# Altium schematic sheet LithiumChargerShematics.SchDoc
size A4
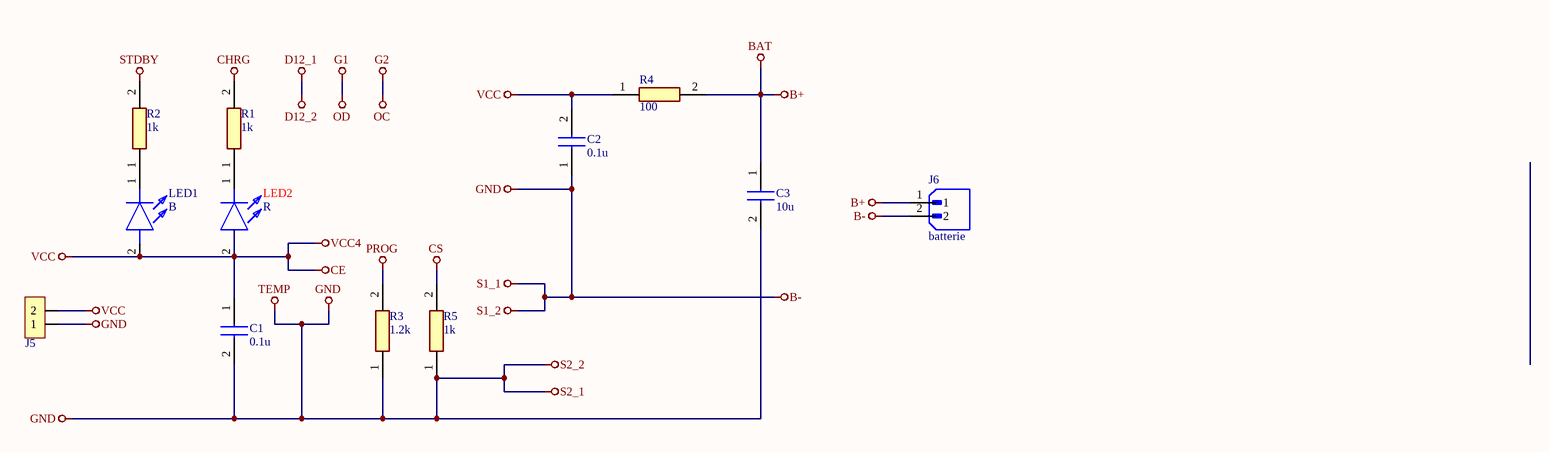
[diagram p0: LithiumChargerShematics.SchDoc]

## Parts
C1  0.1u  [CAPC2012X94N]
C2  0.1u  [CAPC2013X140N]
C3  10u  [CAPC2013X140N]
J5  Header Pins  [HEADER PIN 1x2]  (value not drawn)
J6  batterie  [JST_B2B-XH-A(LF)(SN)]
LED1  B  [LEDM2012X80N]
LED2  R  [LEDM2012X80N]
R1  1k  [RESC2012X65N]
R2  1k  [RESC2012X65N]
R3  1.2k  [RESC2012X65N]
R4  100  [RESC2012X65N]
R5  1k  [RESC2012X65N]

## Nets
B+: C3.1(C1) J6.1 R4.2  [also labelled BAT]
B-: C1.2 C2.1(C1) C3.2(C2) J5.1 J6.2 R3.1 R5.1  [also labelled GND, S1_1, S1_2, S2_1, S2_2, TEMP]
CE: C1.1 C2.2(C2) J5.2 LED1.2(A) LED2.2(A) R4.1  [also labelled VCC, VCC4]
CHRG: R1.2
CS: R5.2
PROG: R3.2
STDBY: R2.2
NetLED1_1: LED1.1(K) R2.1
NetLED2_1: LED2.1(K) R1.1

## Library data of the parts
C1 = 08055A331FAT2A: Capacitor; Manufacturer_Name: Kyocera AVX; Datasheet Link: https://componentsearchengine.com/Datasheets/1/06031A100FAT2A.pdf; Height: 0.94mm; Manufacturer_Part_Number: 08055A331FAT2A; Mouser Part Number: 581-08055A331FAT2A; Mouser Price/Stock: https://www.mouser.com/Search/Refine.aspx?Keyword=581-08055A331FAT2A; Arrow Part Number: 08055A331FAT2A; Arrow Price/Stock: https://www.arrow.com/en/products/08055a331fat2a/avx
C2 C3 = 08053C474JAT2A: Capacitor; Manufacturer_Name: Kyocera AVX; Manufacturer_Part_Number: 08053C474JAT2A; Mouser Part Number: 581-08053C474JAT2A; Mouser Price/Stock: https://www.mouser.co.uk/ProductDetail/KYOCERA-AVX/08053C474JAT2A?qs=bb%252B1MDm7h6L8wnHciIrwGg%3D%3D
J5 = Header Pins 1x2
J6 = B2B-XH-A(LF)(SN): Connector Header Through Hole 2 position 0.098 (2.50mm); MF: JST Sales America Inc.; SnapEDA_Link: https://www.snapeda.com/parts/B2B-XH-A(LF)(SN)/JST+Sales+America+Inc./view-part/?ref=snap; Package: None; Value: *; MP: B2B-XH-A(LF)(SN); Check_prices: https://www.snapeda.com/parts/B2B-XH-A(LF)(SN)/JST+Sales+America+Inc./view-part/?ref=eda
LED1 LED2 = 150080GS75000: LED; Manufacturer_Name: Wurth Elektronik; Datasheet Link: https://katalog.we-online.com/led/datasheet/150080GS75000.pdf; Height: 0.8mm; Manufacturer_Part_Number: 150080GS75000; Mouser Part Number: 710-150080GS75000; Mouser Price/Stock: https://www.mouser.co.uk/ProductDetail/Wurth-Elektronik/150080GS75000?qs=2kOmHSv6VfQRoTEZVk1mGA%3D%3D
R1 R3-R5 = CPF0805B102RE1: Resistor; Manufacturer_Name: TE Connectivity; Datasheet Link: http://docs-europe.electrocomponents.com/webdocs/13d1/0900766b813d116f.pdf; Height: 0.65mm; Manufacturer_Part_Number: CPF0805B102RE1
R2 = CPF0805B10K5E1: Resistor; Manufacturer_Name: TE Connectivity; Datasheet Link: http://docs-europe.electrocomponents.com/webdocs/13d1/0900766b813d116f.pdf; Height: 0.65mm; Manufacturer_Part_Number: CPF0805B10K5E1; Mouser Part Number: 279-CPF0805B10K5E1; Mouser Price/Stock: https://www.mouser.com/Search/Refine.aspx?Keyword=279-CPF0805B10K5E1